# EAGLE design valhalla_v0.3 (EAGLE 7.5.0)
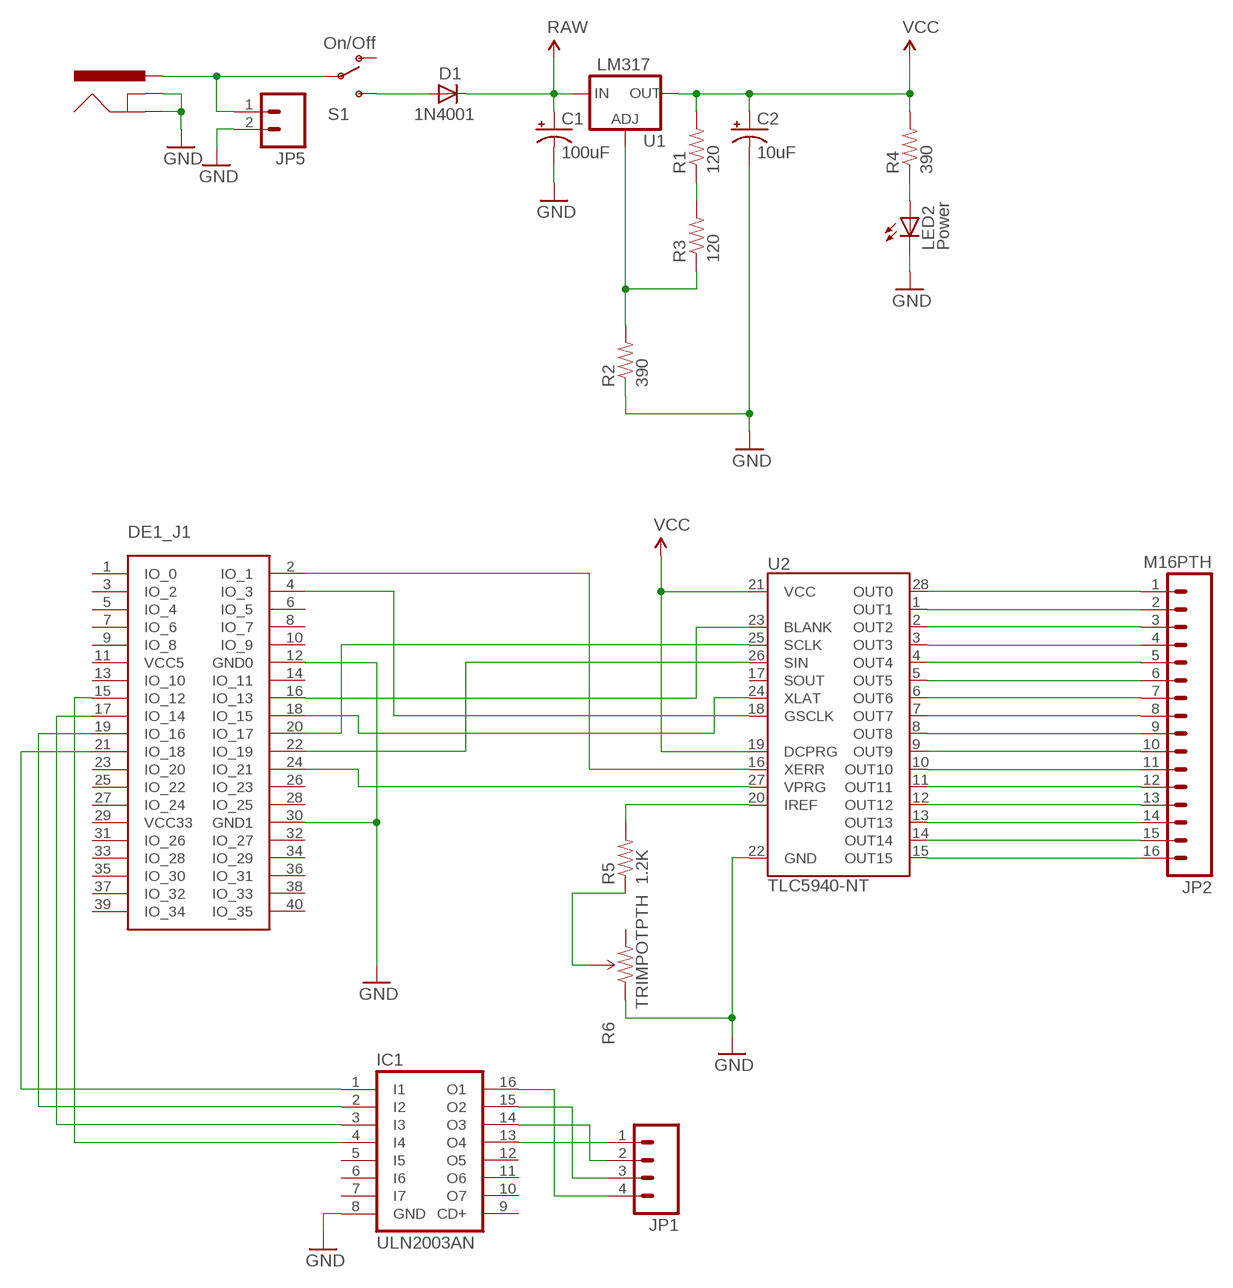
[diagram p0: schematic, sheet 1]

## Parts
C1  100uF  CAP_POLPTH1  [CPOL-RADIAL-100UF-25V]
C2  10uF  CAP_POLPTH2  [CPOL-RADIAL-10UF-25V]
D1  1N4001  DIODEPTH  [DIODE-0.4]
DE1_J1  DE1_GPIO_CON40"  [2X20]
IC1  ULN2003AN  [DIL16]
J1  POWER_JACKPTH  [POWER_JACK_PTH]
JP1  M04PTH  [1X04]
JP2  M16PTH  [1X16]
JP5  M02PTH  [1X02]
LED2  Power  LED5MM  [LED5MM]
R1  120  RESISTORPTH1  [AXIAL-0.3]
R2  390  RESISTORPTH1  [AXIAL-0.3]
R3  120  RESISTORPTH1  [AXIAL-0.3]
R4  390  RESISTORPTH1  [AXIAL-0.3]
R5  1.2K  RESISTORPTH-1/2W  [AXIAL-0.5]
R6  TRIMPOTPTH  [TRIM_POT_PTH]
S1  On/Off  SWITCH-SPSTPTH  [SWITCH-SPST]
U1  LM317  V_REG_317SINK  [TO220-ADJ]
U2  TLC5940-NT  [DIL28-3]

## Nets
BLANK: DE1_J1.16(IO_13) U2.23(BLANK)
GND: C1.2(-) C2.2(-) DE1_J1.12(GND0) DE1_J1.30(GND1) IC1.8(GND) J1.GND J1.GNDBREAK JP5.2 LED2.K(C) R2.P$1 R6.1(CCW) U2.22(GND)
GSCLK: DE1_J1.4(IO_3) U2.18(GSCLK)
IREF: R5.P$2 U2.20(IREF)
N$1: JP2.16 U2.15(OUT15)
N$2: D1.A S1.3(S)
N$3: J1.PWR JP5.1 S1.2(P)
N$4: JP2.15 U2.14(OUT14)
N$5: R5.P$1 R6.2(WIPER)
N$6: JP2.14 U2.13(OUT13)
N$7: JP2.13 U2.12(OUT12)
N$8: LED2.A R4.P$1
N$9: JP2.12 U2.11(OUT11)
N$10: JP2.11 U2.10(OUT10)
N$11: JP2.10 U2.9(OUT9)
N$12: JP2.9 U2.8(OUT8)
N$13: JP2.8 U2.7(OUT7)
N$14: JP2.7 U2.6(OUT6)
N$15: JP2.6 U2.5(OUT5)
N$16: JP2.5 U2.4(OUT4)
N$17: JP2.4 U2.3(OUT3)
N$18: JP2.3 U2.2(OUT2)
N$19: JP2.2 U2.1(OUT1)
N$20: JP2.1 U2.28(OUT0)
N$21: DE1_J1.15(IO_12) IC1.4(I4)
N$22: R1.P$1 R3.P$2
N$23: DE1_J1.17(IO_14) IC1.3(I3)
N$24: R2.P$2 R3.P$1 U1.ADJ
N$25: DE1_J1.19(IO_16) IC1.2(I2)
N$26: DE1_J1.21(IO_18) IC1.1(I1)
N$27: IC1.13(O4) JP1.1
N$28: IC1.14(O3) JP1.2
N$29: IC1.15(O2) JP1.3
N$30: IC1.16(O1) JP1.4
RAW: C1.1(+) D1.C U1.IN
SCLK: DE1_J1.20(IO_17) U2.25(SCLK)
SIN: DE1_J1.22(IO_19) U2.26(SIN)
VCC: C2.1(+) R1.P$2 R4.P$2 U1.OUT U2.19(DCPRG) U2.21(VCC)
VPRG: DE1_J1.24(IO_21) U2.27(VPRG)
XERR: DE1_J1.2(IO_1) U2.16(XERR)
XLAT: DE1_J1.18(IO_15) U2.24(XLAT)
Unconnected: DE1_J1.1(IO_0) DE1_J1.3(IO_2) DE1_J1.5(IO_4) DE1_J1.6(IO_5) DE1_J1.7(IO_6) DE1_J1.8(IO_7) DE1_J1.9(IO_8) DE1_J1.10(IO_9) DE1_J1.13(IO_10) DE1_J1.14(IO_11) DE1_J1.23(IO_20) DE1_J1.25(IO_22) DE1_J1.26(IO_23) DE1_J1.27(IO_24) DE1_J1.28(IO_25) DE1_J1.31(IO_26) DE1_J1.32(IO_27) DE1_J1.33(IO_28) DE1_J1.34(IO_29) DE1_J1.35(IO_30) DE1_J1.36(IO_31) DE1_J1.37(IO_32) DE1_J1.38(IO_33) DE1_J1.39(IO_34) DE1_J1.40(IO_35) IC1.5(I5) IC1.6(I6) IC1.7(I7) IC1.9(CD+) IC1.10(O7) IC1.11(O6) IC1.12(O5) R6.3(CW) S1.1(O) U2.17(SOUT)

## Power pins joined to a net without a drawn wire
VCC5: DE1_J1.11(VCC5)
VCC33: DE1_J1.29(VCC33)

## Library data of the parts
C1 C2 = SparkFun:CAP_POL: Capacitor Polarized These are standard SMD and PTH capacitors. Normally 10uF, 47uF, and 100uF in electrolytic and tantalum varieties. Always verify the external diameter of the through hole cap, it varies with capacity, voltage, and manufacturer. The EIA devices should be standard.
D1 = SparkFun:DIODE: Diode These are standard reverse protection diodes and small signal diodes. SMA package can handle up to about 1A. SOD-323 can handle about 200mA. What the SOD-323 package when ordering, there are some mfgs out there that are 5-pin packages.
DE1_J1 = connectors:DE1_GPIO_CON40: DE1 GPIO Connector This is the 40 pin GPIO expansion connector for DE1 board.
IC1 = uln-udn:ULN2003A: DRIVER ARRAY
J1 = SparkFun:POWER_JACK: Power Jack This is the standard 5.5mm barrel jack for power. The PTH is the most common, proven, reliable, footprint. All others are experimental. The Slot footprint only works if the mill layer is transmitted to the PCB fab house so be warned. Spark Fun Electronics SKU : PRT-00119. Mating wall wart : TOL-00298 (and others)
JP1 = SparkFun-Connectors:M04: Header 4 Standard 4-pin 0.1" header. Use with straight break away headers (SKU : PRT-00116), right angle break away headers (PRT-00553), swiss pins (PRT-00743), machine pins (PRT-00117), and female headers (PRT-00115). Molex polarized connector foot print use with SKU : PRT-08231 with associated crimp pins and housings. 1MM SMD Version SKU: PRT-10208
JP2 = SparkFun-Connectors:M16: 1x16 .1" header
JP5 = SparkFun:M02: Header 2 Standard 2-pin 0.1" header. Use with straight break away headers (SKU : PRT-00116), right angle break away headers (PRT-00553), swiss pins (PRT-00743), machine pins (PRT-00117), and female headers (PRT-00115). Molex polarized connector foot print use with SKU : PRT-08233 with associated crimp pins and housings.
LED2 = SparkFun-Nate:LED
R1-R4 = SparkFun:RESISTOR: Resistor
R5 = SparkFun-Resistors:RESISTOR: Resistor
R6 = SparkFun-Electromechanical:TRIMPOT: Various small potentiometers for "set-and-forget" applications
S1 = SparkFun:SWITCH-SPST: SPST Switch Simple slide switch. Spark Fun Electronics SKU : COM-00102
U1 = SparkFun:V_REG_317: Voltage Regulator Standard LM317 adjustable voltage regulator. AOI (Adjust Output Input). Google 'LM317 Calculator' for easy to use app to get the two resistor values needed. 240/720 for 5V output. 240/390 for 3.3V output. Spark Fun Electronics SKU : COM-00527
U2 = SparkFun-DigitalIC:TLC5940: 16-channel LED Driver with Dot Correction and Grayscale PWM Control The TLC5940 is a 16-channel, constant-current sink LED driver. Each channel has an individually adjustable 4096-step grayscale PWM brightness control and a 64-step, constant-current sink (dot correction). The dot correction adjusts the brightness variations between LED channels and other LED drivers. The dot correction data is stored in an integrated EEPROM. Both grayscale control and dot correction are accessible via a serial interface. A single external resistor sets the maximum current value of all 16 channels. Packages: 28-pin HTSSOP 32-pin 5x5mm QFN 28-pin DIP

## Net classes
0 default: width 0.254 mm

## Board
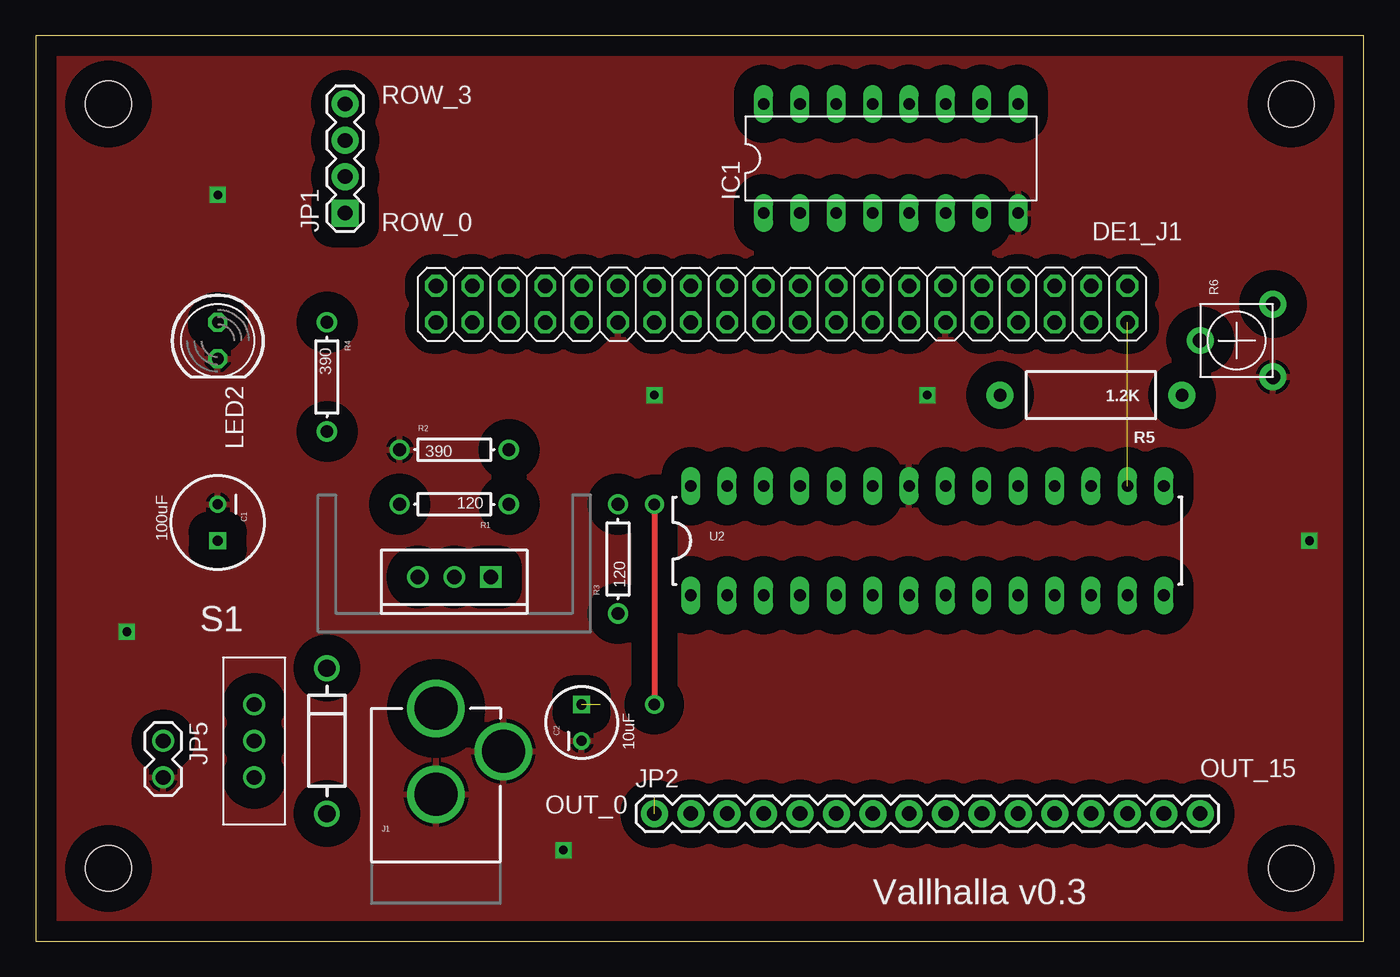
[diagram p1: board, top side]
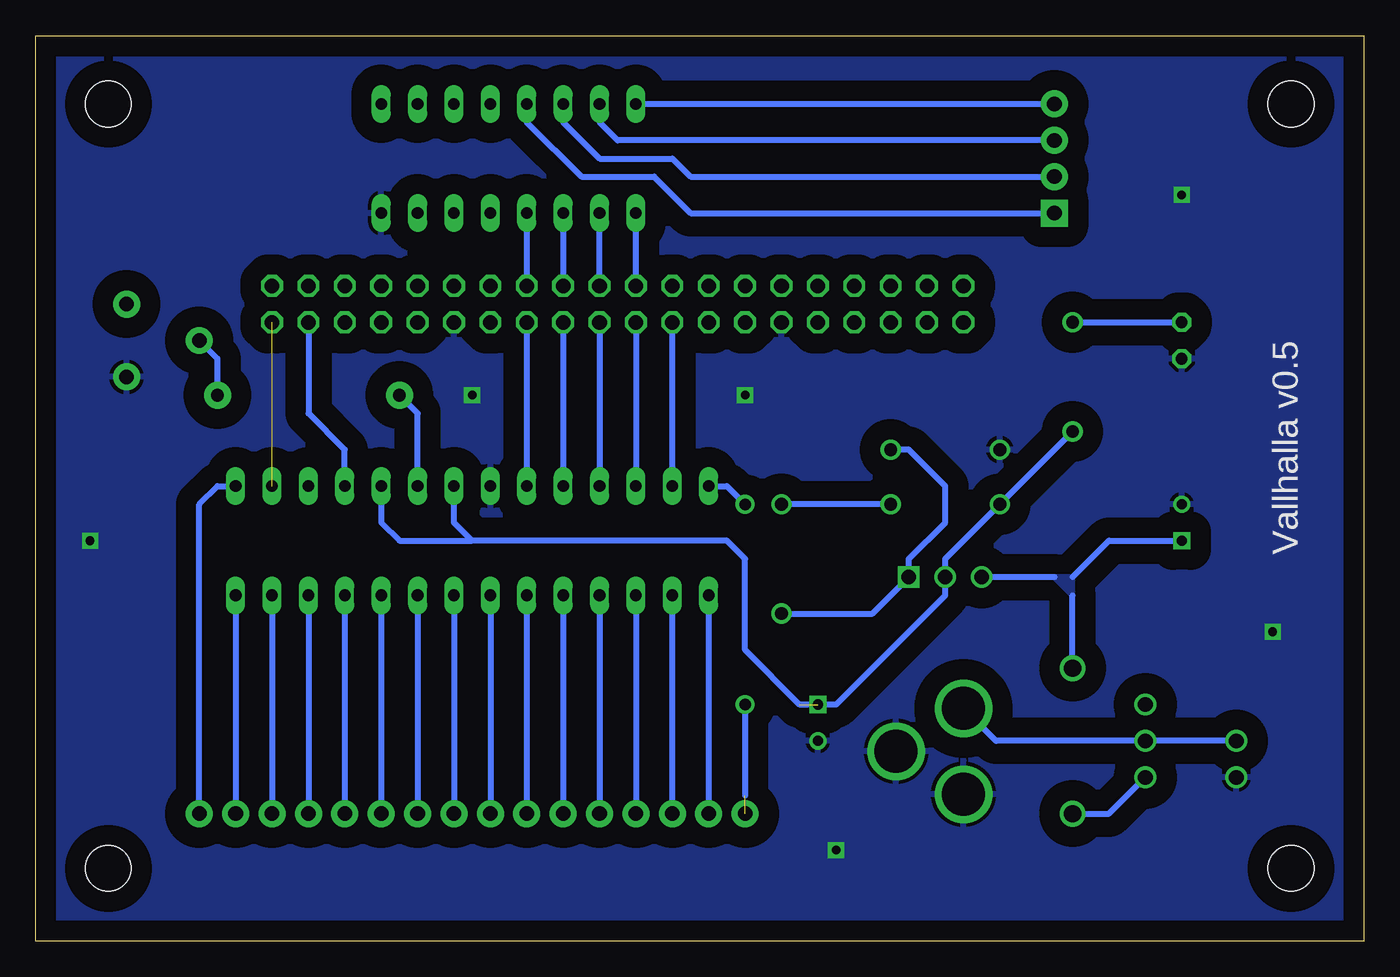
[diagram p2: board, bottom side, seen from below]

Size 92.69 x 63.17 mm. Coordinates in mm from the lower left corner, seen from the top.
Outline: 0,0 92.69,0 92.69,63.17 0,63.17 0,0
Copper layers (1*16): Top 0.035mm / dielectric 1.5mm / Bottom 0.035mm
Design rules "SparkFun-2-layer-STANDARD": minimum track width 10mil, minimum drill 20mil, track to track 10mil, track to pad 8mil, pad to pad 8mil, via to via 10mil, smd to smd 8mil, copper to edge 8mil, drill to drill 8mil, minimum pad ring 10mil, minimum via ring 10mil, stop-mask expansion 4mil, vias tented up to drill 20mil, thermal gap 10mil
Holes 3.2 mm at 5.08,58.42 87.63,58.42 87.63,5.08 5.08,5.08

### Footprints (pad centres in the part's own frame; a part is rotated, then mirrored left to right if it is on the bottom)
CPOL-RADIAL-100UF-25V = drill 0.7 square: 1 1.27,0 | drill 0.7: 2 -1.27,0
CPOL-RADIAL-10UF-25V = drill 0.7 square: 1 1.27,0 | drill 0.7: 2 -1.27,0
DIODE-0.4 = drill 1.2: A 0,0; C 10.16,0
2X20 = drill 1.016 octagon: 1 -24.13,-1.27; 2 -24.13,1.27; 3 -21.59,-1.27; 4 -21.59,1.27; 5 -19.05,-1.27; 6 -19.05,1.27; 7 -16.51,-1.27; 8 -16.51,1.27; 9 -13.97,-1.27; 10 -13.97,1.27; 11 -11.43,-1.27; 12 -11.43,1.27; 13 -8.89,-1.27; 14 -8.89,1.27; 15 -6.35,-1.27; 16 -6.35,1.27; 17 -3.81,-1.27; 18 -3.81,1.27; 19 -1.27,-1.27; 20 -1.27,1.27; 21 1.27,-1.27; 22 1.27,1.27; 23 3.81,-1.27; 24 3.81,1.27; 25 6.35,-1.27; 26 6.35,1.27; 27 8.89,-1.27; 28 8.89,1.27; 29 11.43,-1.27; 30 11.43,1.27; 31 13.97,-1.27; 32 13.97,1.27; 33 16.51,-1.27; 34 16.51,1.27; 35 19.05,-1.27; 36 19.05,1.27; 37 21.59,-1.27; 38 21.59,1.27; 39 24.13,-1.27; 40 24.13,1.27
DIL16 = drill 0.813 long: 1 -8.89,-3.81; 2 -6.35,-3.81; 3 -3.81,-3.81; 4 -1.27,-3.81; 5 1.27,-3.81; 6 3.81,-3.81; 7 6.35,-3.81; 8 8.89,-3.81; 9 8.89,3.81; 10 6.35,3.81; 11 3.81,3.81; 12 1.27,3.81; 13 -1.27,3.81; 14 -3.81,3.81; 15 -6.35,3.81; 16 -8.89,3.81
POWER_JACK_PTH = drill 2.997: GND 0,7.7; GNDBREAK 4.7,10.7; PWR 0,13.7
1X04 = drill 1.016 pad 1.88 square: 1 0,0 | drill 1.016 pad 1.88: 2 2.54,0; 3 5.08,0; 4 7.62,0
1X16 = drill 1.016 pad 1.88: 1 0,0; 2 2.54,0; 3 5.08,0; 4 7.62,0; 5 10.16,0; 6 12.7,0; 7 15.24,0; 8 17.78,0; 9 20.32,0; 10 22.86,0; 11 25.4,0; 12 27.94,0; 13 30.48,0; 14 33.02,0; 15 35.56,0; 16 38.1,0
1X02 = drill 1.016: 1 0,0; 2 2.54,0
LED5MM = drill 0.813 octagon: A -1.27,0; K 1.27,0
AXIAL-0.3 = drill 0.9: P$1 -3.81,0; P$2 3.81,0
AXIAL-0.5 = drill 0.9 pad 1.88: P$1 -6.35,0; P$2 6.35,0
TRIM_POT_PTH = drill 1 pad 1.88: 1 -2.54,-2.54; 2 0,2.54; 3 2.54,-2.54
SWITCH-SPST = drill 1.016: 1 0,2.54; 2 0,0; 3 0,-2.54
TO220-ADJ = drill 1 square: ADJ -2.54,0 | drill 1: IN 2.54,0; OUT 0,0
DIL28-3 = drill 0.813 long: 1 -16.51,-3.81; 2 -13.97,-3.81; 3 -11.43,-3.81; 4 -8.89,-3.81; 5 -6.35,-3.81; 6 -3.81,-3.81; 7 -1.27,-3.81; 8 1.27,-3.81; 9 3.81,-3.81; 10 6.35,-3.81; 11 8.89,-3.81; 12 11.43,-3.81; 13 13.97,-3.81; 14 16.51,-3.81; 15 16.51,3.81; 16 13.97,3.81; 17 11.43,3.81; 18 8.89,3.81; 19 6.35,3.81; 20 3.81,3.81; 21 1.27,3.81; 22 -1.27,3.81; 23 -3.81,3.81; 24 -6.35,3.81; 25 -8.89,3.81; 26 -11.43,3.81; 27 -13.97,3.81; 28 -16.51,3.81

### Placement (x,y rotation side)
C1  12.7,29.21 270 top
C2  38.1,15.24 90 top
D1  20.32,8.89 90 top
DE1_J1  52.07,44.45 180 top
IC1  59.69,54.61 0 top
J1  27.94,2.54 0 top
JP1  21.59,50.8 90 top
JP2  43.18,8.89 0 top
JP5  8.89,13.97 270 top
LED2  12.7,41.91 270 top
R1  29.21,30.48 180 top
R2  29.21,34.29 0 top
R3  40.64,26.67 90 top
R4  20.32,39.37 270 top
R5  73.66,38.1 180 top
R6  83.82,41.91 90 top
S1  15.24,13.97 0 top
U1  29.21,25.4 180 top
U2  62.23,27.94 0 top

### Tracks (layer width: path | path; a pad name or v marks a point on that pad's centre or on a via)
BLANK
  Bottom 0.406: DE1_J1.16 U2.23
GND  (via drill 0.6)
  other vias: 6.35,21.59 12.7,52.07 36.83,6.35 88.9,27.94 43.18,38.1 62.23,38.1
  pour Bottom (isolate 1.422): 0,64.77 0,0 92.71,0 92.71,64.77
  pour Top (isolate 1.422): 0,63.5 0,0 92.71,-1.27 92.71,64.77
GSCLK
  Bottom 0.406: U2.18 71.12,34.29 73.66,36.83 DE1_J1.4
IREF
  Bottom 0.406: U2.20 66.04,36.83 R5.P$2
N$1
  Bottom 0.406: JP2.16 81.28,30.48 80.01,31.75 U2.15
N$2
  Bottom 0.406: D1.A 17.78,8.89 S1.3
N$3
  Bottom 0.406: JP5.1 S1.2 25.67,13.97 J1.PWR
N$4
  Bottom 0.406: U2.14 JP2.15
N$5
  Bottom 0.406: R5.P$1 80.01,40.64 R6.2
N$6
  Bottom 0.406: U2.13 JP2.14
N$7
  Bottom 0.406: U2.12 JP2.13
N$8
  Bottom 0.406: R4.P$1 LED2.A
N$9
  Bottom 0.406: U2.11 JP2.12
N$10
  Bottom 0.406: U2.10 JP2.11
N$11
  Bottom 0.406: U2.9 JP2.10
N$12
  Bottom 0.406: U2.8 JP2.9
N$13
  Bottom 0.406: U2.7 JP2.8
N$14
  Bottom 0.406: U2.6 JP2.7
N$15
  Bottom 0.406: U2.5 JP2.6
N$16
  Bottom 0.406: U2.4 JP2.5
N$17
  Bottom 0.406: U2.3 JP2.4
N$18
  Bottom 0.406: JP2.3 U2.2
N$19
  Bottom 0.406: U2.1 JP2.2
N$20  (via drill 0.8 pad 1.02)  (1 unrouted)
  Top 0.406: v43.18,30.48 v43.18,16.51
  Bottom 0.406: U2.28 44.45,31.75 v43.18,30.48 | v43.18,16.51 43.18,10.16
N$21
  Bottom 0.406: IC1.4 DE1_J1.15
N$22
  Bottom 0.406: R1.P$1 R3.P$2
N$23
  Bottom 0.406: IC1.3 DE1_J1.17
N$24
  Bottom 0.406: R3.P$1 34.29,22.86 U1.ADJ 31.75,26.67 29.21,29.21 29.21,31.75 31.75,34.29 R2.P$2
N$25
  Bottom 0.406: DE1_J1.19 IC1.2
N$26
  Bottom 0.406: DE1_J1.21 IC1.1
N$27
  Bottom 0.406: IC1.13 58.42,57.15 54.61,53.34 49.53,53.34 46.99,50.8 JP1.1
N$28
  Bottom 0.406: IC1.14 55.88,57.15 53.34,54.61 48.26,54.61 46.99,53.34 JP1.2
N$29
  Bottom 0.406: JP1.3 52.07,55.88 53.34,57.15 IC1.15
N$30
  Bottom 0.406: IC1.16 JP1.4
RAW
  Bottom 0.406: D1.C 20.32,24.13 | C1.1 17.78,27.94 20.32,25.4 | 21.59,25.4 U1.IN
  pour Bottom: 20.32,24.13 20.32,25.4 21.59,25.4
SCLK
  Bottom 0.406: DE1_J1.20 U2.25
SIN
  Bottom 0.406: DE1_J1.22 U2.26
VCC  (1 unrouted)
  Bottom 0.406: R4.P$2 R1.P$2 29.21,26.67 U1.OUT 29.21,24.13 36.83,16.51 39.37,16.51 43.18,20.32 43.18,26.67 44.45,27.94 62.23,27.94 | 62.23,27.94 63.5,29.21 U2.21 | U2.19 68.58,29.21 67.31,27.94 62.23,27.94
VPRG
  Bottom 0.406: U2.27 DE1_J1.24
XERR  (1 unrouted)
XLAT
  Bottom 0.406: DE1_J1.18 U2.24

### Text on the board
tPlace: ROW_3 | ROW_0 | OUT_15 | OUT_0 | Vallhalla v0.3
bPlace: Vallhalla v0.5